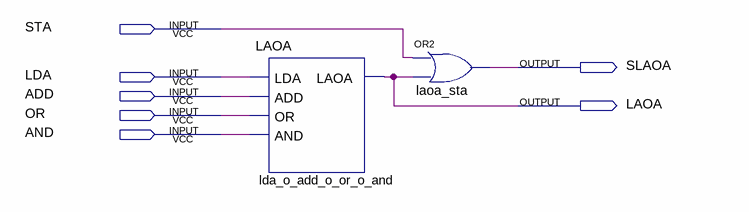
[diagram p0: schematic sheet]
// Quartus schematic SLAOA.bdf as structural Verilog: 2 symbols, 7 pins
module SLAOA (
  input  STA,
  input  LDA,
  input  ADD,
  input  OR,
  input  AND,
  output SLAOA,
  output LAOA
);

  LAOA lda_o_add_o_or_o_and (.LDA(LDA), .ADD(ADD), .OR(OR), .AND(AND), .LAOA(LAOA));
  or laoa_sta (SLAOA, STA, LAOA);
endmodule
